# Altium project 15W-Dual-Transmitter.PrjPcb
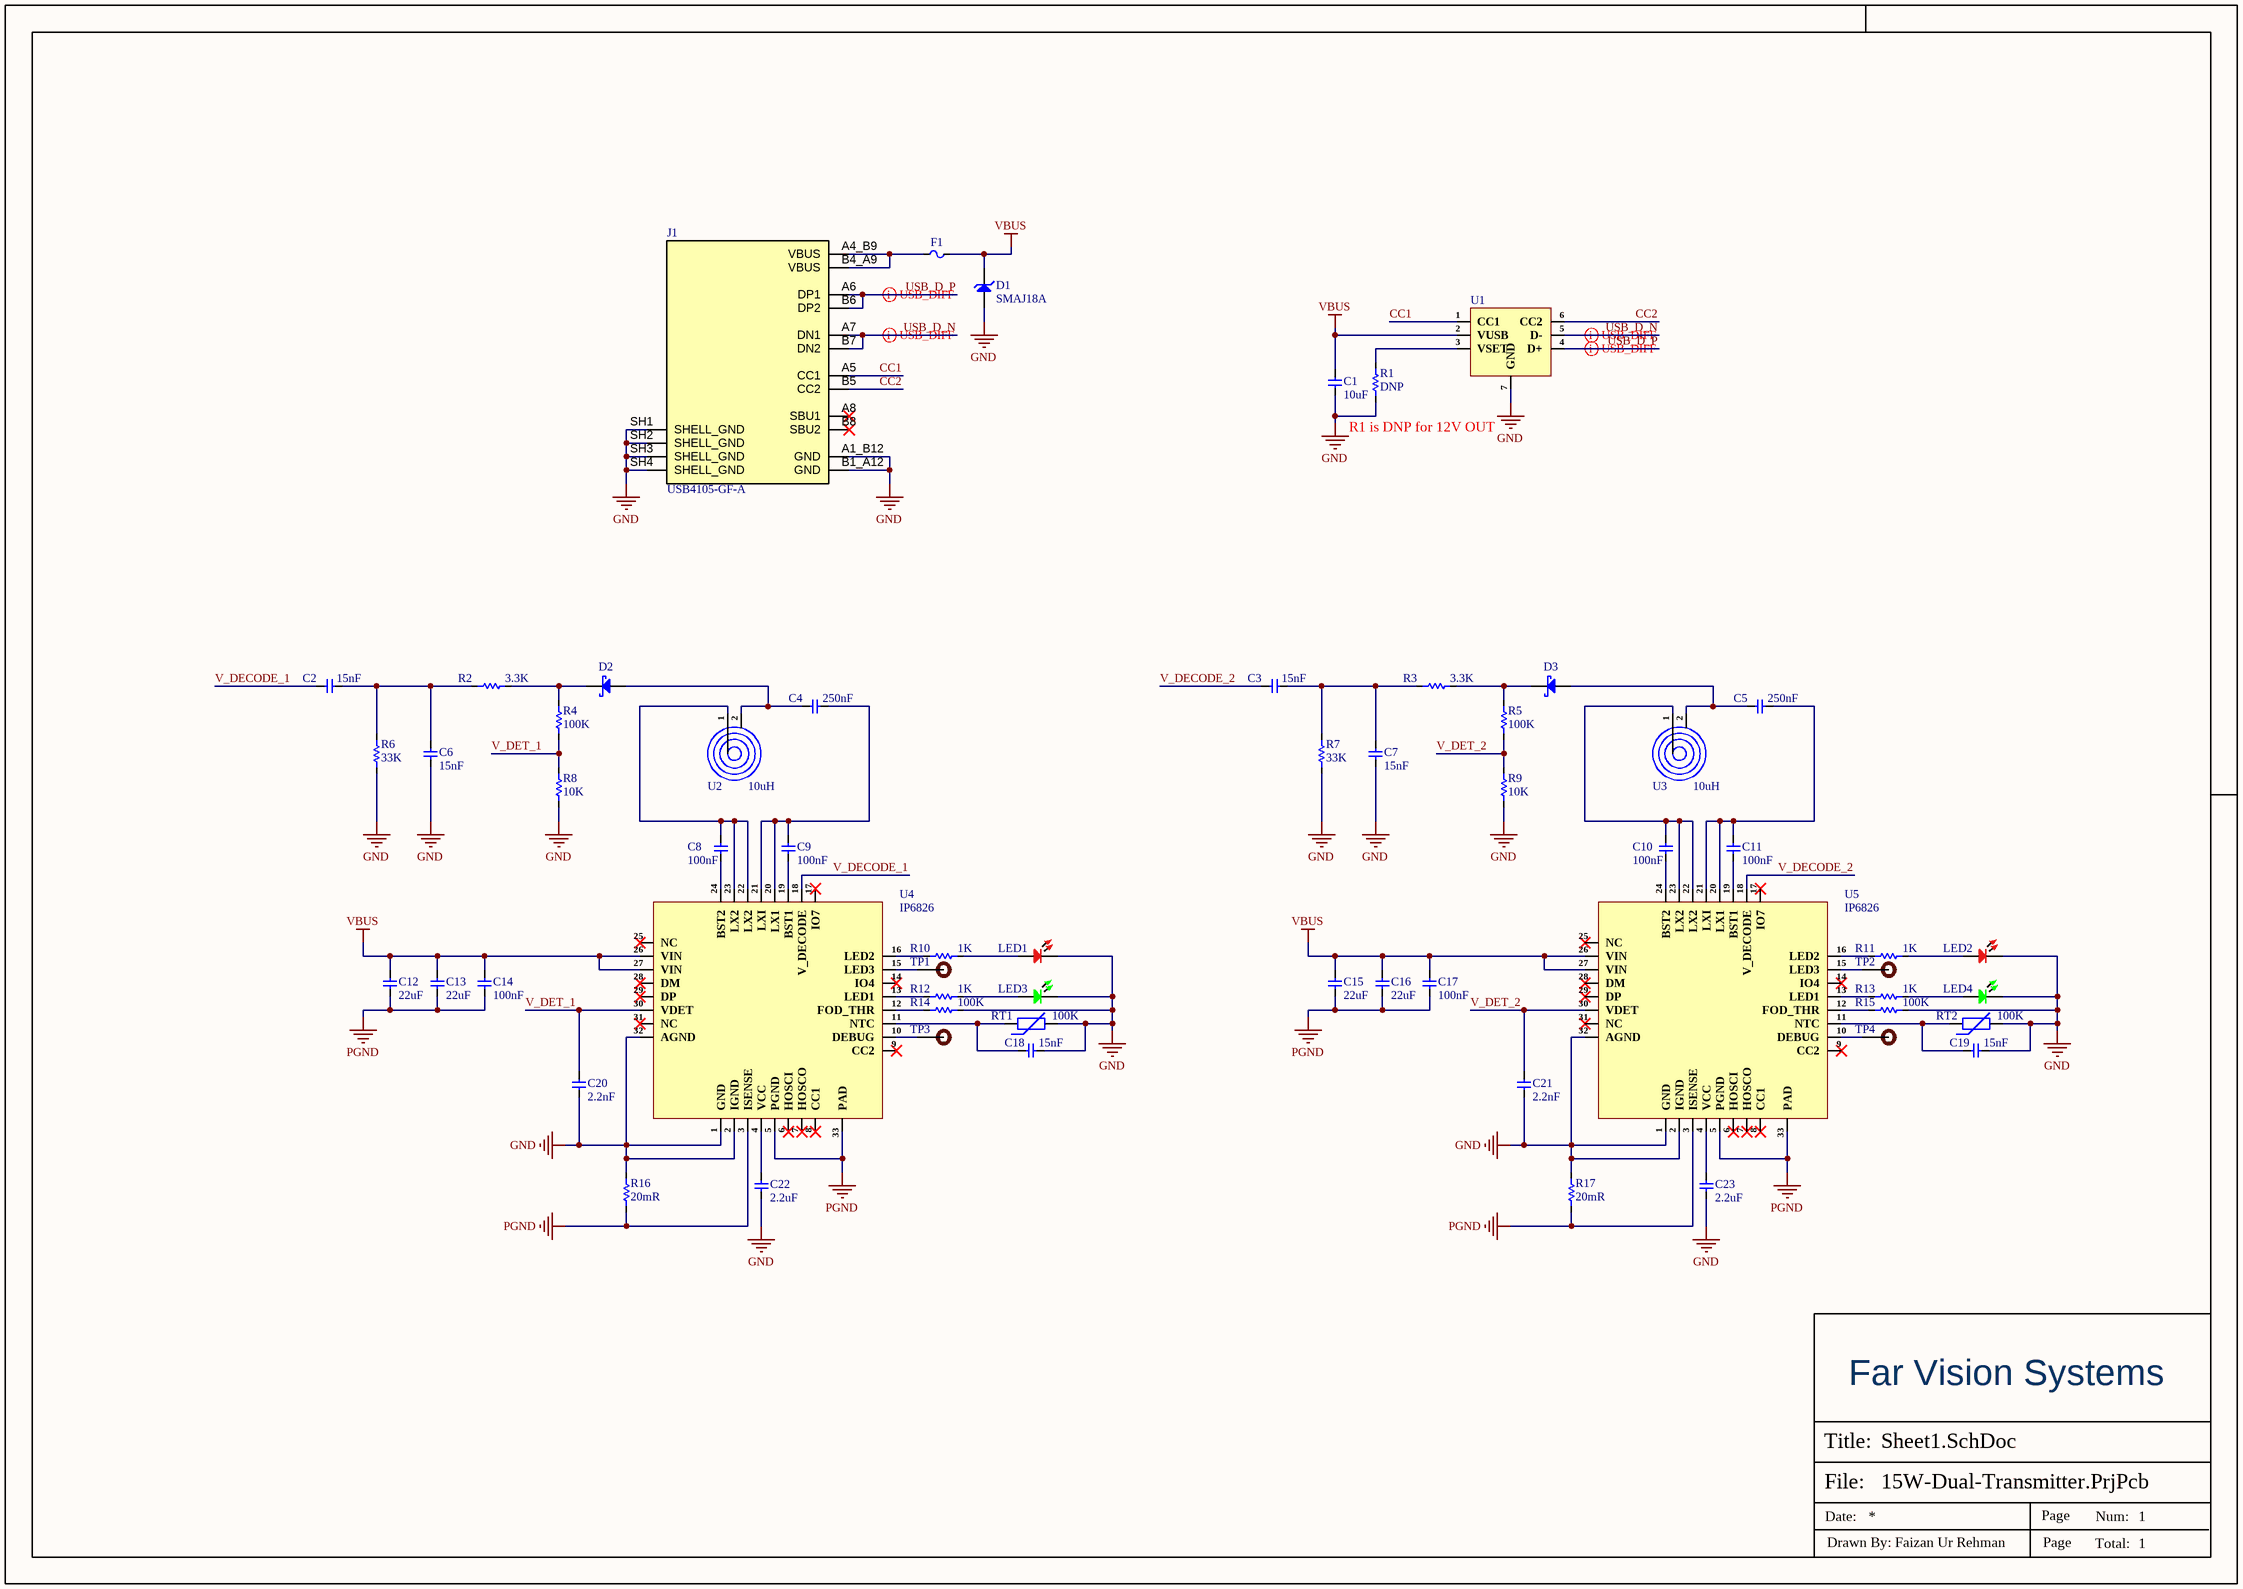
[diagram p0: Sheet1.SchDoc]
1 sheet, 60 parts. Net scope: global (net labels, ports and power ports of the same name join across sheets).
Board file: 15W-Dual-Transmitter.PcbDoc

## Sheet Sheet1.SchDoc
size 420 x 297 mm; SheetNumber: 1; SheetTotal: 1

### Parts
C1  10uF  [Cap-0603]
C2  15nF  [Cap-0603]
C3  15nF  [Cap-0603]
C4  250nF  [CAP-TH_L9.0-W3.5-P7.50-D1.0]
C5  250nF  [CAP-TH_L9.0-W3.5-P7.50-D1.0]
C6  15nF  [Cap-0603]
C7  15nF  [Cap-0603]
C8  100nF  [Cap-0603]
C9  100nF  [Cap-0603]
C10  100nF  [Cap-0603]
C11  100nF  [Cap-0603]
C12  22uF  [Cap-0805]
C13  22uF  [Cap-0805]
C14  100nF  [Cap-0603]
C15  22uF  [Cap-0805]
C16  22uF  [Cap-0805]
C17  100nF  [Cap-0603]
C18  15nF  [Cap-0603]
C19  15nF  [Cap-0603]
C20  2.2nF  [Cap-0603]
C21  2.2nF  [Cap-0603]
C22  2.2uF  [Cap-0603]
C23  2.2uF  [Cap-0603]
D1  SMAJ18A  [SMA(DO-214AC)]
D2  1N5819HW-7-F  [SOD-123]  (value not drawn)
D3  1N5819HW-7-F  [SOD-123]  (value not drawn)
F1  BSMD1812-300-24V  [Fuse-1812_]  (value not drawn)
J1  USB4105-GF-A  [GCT_USB4105-GF-A]
LED1  RED  [LED-0603]  (value not drawn)
LED2  RED  [LED-0603]  (value not drawn)
LED3  Emerald  [LED-0603]  (value not drawn)
LED4  Emerald  [LED-0603]  (value not drawn)
R1  DNP  [Res-0603]
R2  3.3K  [Res-0603]
R3  3.3K  [Res-0603]
R4  100K  [Res-0603]
R5  100K  [Res-0603]
R6  33K  [Res-0603]
R7  33K  [Res-0603]
R8  10K  [Res-0603]
R9  10K  [Res-0603]
R10  1K  [Res-0603]
R11  1K  [Res-0603]
R12  1K  [Res-0603]
R13  1K  [Res-0603]
R14  100K  [Res-0603]
R15  100K  [Res-0603]
R16  20mR  [RES-2512]
R17  20mR  [RES-2512]
RT1  100K  [Res-0603]
RT2  100K  [Res-0603]
TP1  TEST POINT  [Test-point]  (value not drawn)  (no BOM)
TP2  TEST POINT  [Test-point]  (value not drawn)  (no BOM)
TP3  TEST POINT  [Test-point]  (value not drawn)  (no BOM)
TP4  TEST POINT  [Test-point]  (value not drawn)  (no BOM)
U1  HUSB237-AA001-DN06R  [DFN-6L-EP(2x2)]  (value not drawn)
U2  10uH  [760308103102]
U3  10uH  [760308103102]
U4  IP6826  [QFN-32_L5.0-W5.0-P0.50-BL-EP3.8]
U5  IP6826  [QFN-32_L5.0-W5.0-P0.50-BL-EP3.8]

### Nets
GND: C1.1 C6.1 C7.1 C18.2 C19.2 C20.1 C21.1 C22.1 C23.1 D1.2(A) J1.A1_B12(GND) J1.B1_A12(GND) J1.SH1(SHELL_GND) J1.SH2(SHELL_GND) J1.SH3(SHELL_GND) J1.SH4(SHELL_GND) LED1.2 LED2.2 LED3.2 LED4.2 R1.1 R6.1 R7.1 R8.1 R9.1 R14.2 R15.2 R16.2 R17.2 RT1.2 RT2.2 U1.7(GND) U4.1(GND) U4.2(IGND) U4.32(AGND) U5.1(GND) U5.2(IGND) U5.32(AGND)
PGND: C12.1 C13.1 C14.1 C15.1 C16.1 C17.1 R16.1 R17.1 U4.3(ISENSE) U4.5(PGND) U4.33(PAD) U5.3(ISENSE) U5.5(PGND) U5.33(PAD)
VBUS: C1.2 C12.2 C13.2 C14.2 C15.2 C16.2 C17.2 D1.1(K) F1.2 U1.2(VUSB) U4.26(VIN) U4.27(VIN) U5.26(VIN) U5.27(VIN)
CC1: J1.A5(CC1) U1.1(CC1)
CC2: J1.B5(CC2) U1.6(CC2)
USB_D_N: J1.A7(DN1) J1.B7(DN2) U1.5(D-)
USB_D_P: J1.A6(DP1) J1.B6(DP2) U1.4(D+)
V_DECODE_1: C2.2 U4.18(V_DECODE)
V_DECODE_2: C3.2 U5.18(V_DECODE)
V_DET_1: C20.2 R4.1 R8.2 U4.30(VDET)
V_DET_2: C21.2 R5.1 R9.2 U5.30(VDET)
NetC2_1: C2.1 C6.2 R2.1 R6.2
NetC3_1: C3.1 C7.2 R3.1 R7.2
NetC4_1: C4.1 D2.1(A) U2.2
NetC4_2: C4.2 C9.2 U4.20(LX1) U4.21(LXI)
NetC5_1: C5.1 D3.1(A) U3.2
NetC5_2: C5.2 C11.2 U5.20(LX1) U5.21(LXI)
NetC8_1: C8.1 U4.24(BST2)
NetC8_2: C8.2 U2.1 U4.22(LX2) U4.23(LX2)
NetC9_1: C9.1 U4.19(BST1)
NetC10_1: C10.1 U5.24(BST2)
NetC10_2: C10.2 U3.1 U5.22(LX2) U5.23(LX2)
NetC11_1: C11.1 U5.19(BST1)
NetC18_1: C18.1 RT1.1 U4.11(NTC)
NetC19_1: C19.1 RT2.1 U5.11(NTC)
NetC22_2: C22.2 U4.4(VCC)
NetC23_2: C23.2 U5.4(VCC)
NetD2_2: D2.2(K) R2.2 R4.2
NetD3_2: D3.2(K) R3.2 R5.2
NetF1_1: F1.1 J1.A4_B9(VBUS) J1.B4_A9(VBUS)
NetLED1_1: LED1.1 R10.2
NetLED2_1: LED2.1 R11.2
NetLED3_1: LED3.1 R12.2
NetLED4_1: LED4.1 R13.2
NetR1_2: R1.2 U1.3(VSET)
NetR10_1: R10.1 U4.16(LED2)
NetR11_1: R11.1 U5.16(LED2)
NetR12_1: R12.1 U4.13(LED1)
NetR13_1: R13.1 U5.13(LED1)
NetR14_1: R14.1 U4.12(FOD_THR)
NetR15_1: R15.1 U5.12(FOD_THR)
NetTP1_1: TP1.1 U4.15(LED3)
NetTP2_1: TP2.1 U5.15(LED3)
NetTP3_1: TP3.1 U4.10(DEBUG)
NetTP4_1: TP4.1 U5.10(DEBUG)

Not connected (* = marked no-connect by the designer): J1 A8(SBU1)* B8(SBU2)*; U4 6(HOSCI)* 7(HOSCO)* 8(CC1)* 9(CC2)* 14(IO4)* 17(IO7)* 25(NC)* 28(DM)* 29(DP)* 31(NC)*; U5 6(HOSCI)* 7(HOSCO)* 8(CC1)* 9(CC2)* 14(IO4)* 17(IO7)* 25(NC)* 28(DM)* 29(DP)* 31(NC)*

### Layout directives
differential pair; net class USB_DIFF; differential pair class USB_DIFF_Lines; rule Matched Net Lengths [Tolerance = 20mil]; rule Impedance Constraint [Min = 85.00    Max = 95.00    ]: USB_D_N, USB_D_P

### Notes on the sheet
- R1 is DNP for 12V OUT
- Far Vision Systems
- File:
- Title:
- Date:
- Page
- Num:
- Total:
- Drawn By: Faizan Ur Rehman

### Library data of the parts
C1 = CAP-0603: GRM188R61E106KA73D
C2 C3 C6 C7 C18 C19 = CAP-0603: CC0402KRX7R9BB153
C4 C5 = MPP254J2A0701
C8-C11 C14 C17 = CAP-0603: GRM188R71H104KA93D
C12 C13 C15 C16 = CAP-0805: CC0805MKX5R8BB226
C20 C21 = CAP-0603: GRM188R71H222KA01D
C22 C23 = CAP-0603: GRM155R61E225KE11D
D1 = SMAJ18A: 13.7A 400W 29.2V 20V Unidirectional 18V SMA(DO-214AC) Electrostatic and Surge Protection (TVS/ESD) ROHS; Manufacturer: SMC; Manufacturer Part Number: SMAJ18A; Package: SMA(DO-214AC); LCSC Part Number: C499735; Item Type: TVS/ESD; ComponentLink1Description: LCSC; ComponentLink1URL: https://www.lcsc.com/product-detail/Electrostatic-and-Surge-Protection-TVS-ESD_SMC-Sangdest-Microelectronicstronic-Nanjing-SMAJ18A_C499735.html
D2 D3 = 1N5819HW-7-F: DIODE SCHOTTKY 40V 1A SOD123; Manufacturer: Diodes; Forward Voltage: 450mV; Max Reverse Current: 50uA; Element Configuration: Single; Max Forward Surge Current (Ifsm): 25A; Max Power Dissipation: 450mW; Polarity: Standard; Capacitance: 110pF; Supplier 1: Digi-Key; Manufacturer Part Number: 1N5819HW-7-F; RoHS: Yes; Category: Schottky Diodes; Pricing 1: 1=0.46000, 10=0.34500, 100=0.19530, 500=0.12936, 1000=0.09918 (USD); Case/Package: SOD-123-2; Number of Pins: 2; Weight: 0.000353oz; Contact Plating: Tin,Matte; Min Operating Temperature: -65°C; Max Operating Temperature: 125°C; Forward Current: 1A; Max Repetitive Reverse Voltage (Vrrm): 40V; Packaging: Tape and Reel; Peak Non-Repetitive Surge Current: 25A; Package Quantity: 3000; Average Rectified Current: 1A; Termination: SMD/SMT; Voltage Rating (DC): 40V; Current Rating: 1A; Output Current: 1A; Max Reverse Voltage (DC): 40V; Series: -; Length: 2.85mm; Width: 1.7mm; Height: 1.25mm; Radiation Hardening: No; RoHS Compliant: Yes; REACH SVHC: No SVHC; Lead Free: Lead Free; ComponentLink1URL: https://datasheet.ciiva.com/16303/ds30217-16303296.pdf?src-supplier=Future+Electronics; ComponentLink1Description: https://datasheet.ciiva.com/16303/ds30217-16303296.pdf?src-supplier=Future+Electronics; ComponentLink2URL: https://datasheet.ciiva.com/27092/1538419-27092484.pdf?src-supplier=Jameco; ComponentLink2Description: https://datasheet.ciiva.com/27092/1538419-27092484.pdf?src-supplier=Jameco; ComponentLink3URL: https://datasheet.ciiva.com/912/ds30217-912801.pdf?src-supplier=Digi-Key; ComponentLink3Description: https://datasheet.ciiva.com/912/ds30217-912801.pdf?src-supplier=Digi-Key; ComponentLink4URL: https://datasheet.ciiva.com/1177/ds30217-1177089.pdf?src-supplier=Element14; ComponentLink4Description: https://datasheet.ciiva.com/1177/ds30217-1177089.pdf?src-supplier=Element14; ComponentLink5URL: https://datasheet.ciiva.com/912/ds30217-912802.pdf?src-supplier=Digi-Key; ComponentLink5Description: https://datasheet.ciiva.com/912/ds30217-912802.pdf?src-supplier=Digi-Key; ComponentLink6URL: https://datasheet.ciiva.com/912/ds30217-912803.pdf?src-supplier=Digi-Key; ComponentLink6Description: https://datasheet.ciiva.com/912/ds30217-912803.pdf?src-supplier=Digi-Key; ComponentLink7URL: https://datasheet.ciiva.com/8303/ds30217-8303132.pdf?src-supplier=Avnet; ComponentLink7Description: https://datasheet.ciiva.com/8303/ds30217-8303132.pdf?src-supplier=Avnet; ComponentLink8URL: https://datasheet.ciiva.com/25919/ds30217-25919644.pdf?src-supplier=Avnet+Europe; ComponentLink8Description: https://datasheet.ciiva.com/25919/ds30217-25919644.pdf?src-supplier=Avnet+Europe; Supplier Part Number 1: 1N5819HW-FDICT-ND; LCSC Part Number: C82544; Item Type: Diode
F1 = BSMD1812-300-24V: 24V 3A 40A 6A 1812 Resettable Fuses ROHS; Manufacturer: BHFUSE; Item Type: Fuse; Supplier: LCSC; LCSC Part Number: C7500481; Manufacturer Part Number: BSMD1812-300-24V; RoHS: No; ComponentLink1Description: LCSC; ComponentLink1URL: https://www.lcsc.com/product-detail/Resettable-Fuses_BHFUSE-BSMD1812-300-24V_C7500481.html
J1 = USB4105-GF-A: MF: {'manufacturer': u'GCT'}; Package: None; Price: None; Value: *; MP: USB4105-GF-A; Availability: Unavailable
LED1 LED2 = NCD0603R3: RED LED 0603 Light Emitting Diodes; Manufacturer: Foshan NationStar Optoelectronics; Manufacturer Part Number: NCD0603R3; Package: 0603; Item Type: LED; LCSC Part Number: C3151730; ComponentLink1Description: LCSC; ComponentLink1URL: https://www.lcsc.com/product-detail/Light-Emitting-Diodes-LED_Foshan-NationStar-Optoelectronics-NCD0603R3_C3151730.html
LED3 LED4 = NCD0603G2: Emerald 0603 Light Emitting Diodes (LED) ROHS; Manufacturer: Foshan NationStar Optoelectronics; Manufacturer Part Number: NCD0603G2; Package: 0603; LCSC Part Number: C87326; Item Type: LED; ComponentLink1Description: LCSC; ComponentLink1URL: https://www.lcsc.com/product-detail/Light-Emitting-Diodes-LED_Foshan-NationStar-Optoelectronics-NCD0603G2_C87326.html
R1 R12 R13 = RES-0603
R2 R3 = RES-0603: RC0603FR-073K3L
R4 R5 R14 R15 = RES-0603: RT0603BRD07100KL
R6 R7 = RES-0603: RC0603FR-0733KL
R8 R9 = RES-0603: RC0603FR-0710KL
R10 R11 = RES-0603: RC0603FR-071KL
R16 R17 = PA2512FKE7W0R02E: RES 0.02 OHM 1% 2W 2512; Manufacturer: Yageo; Item Type: Resistor; Supplier: Digikey; LCSC Part Number: C375689; Manufacturer Part Number: PA2512FKE7W0R02E; RoHS: No; Stock: 3212; Pricing: 1=0.79, 10=0.514, 25=0.4384, 50=0.3908, 100=0.3503, 250=0.306, 500=0.27824, 1000=0.25464 (USD); ComponentLink1URL: https://datasheet.octopart.com/PA2512FKE7W0R02E-Yageo-datasheet-137700559.pdf?src-supplier=Newark; ComponentLink1Description: https://datasheet.octopart.com/PA2512FKE7W0R02E-Yageo-datasheet-137700559.pdf?src-supplier=Newark
RT1 RT2 = KNTC0603/100KF3950: 100kΩ 100uA 100mW 3950K ±1% 0603 NTC Thermistors ROHS; Manufacturer: KUU; Manufacturer Part Number: KNTC0603/100KF3950; Package: 0603; LCSC Part Number: C2892545; Item Type: NTC Thermistor; ComponentLink1Description: LCSC; ComponentLink1URL: https://lcsc.com/product-detail/NTC-Thermistors_KUU-KNTC0603-100KF3950_C2892545.html
TP1-TP4 = TEST POINT: Test Point ON; Item Type: TEST POINT
U1 = HUSB237-AA001-DN06R: DFN-6L-EP(2x2) USB PD ROHS; Manufacturer: Hynetek; Item Type: IC; Manufacturer Part Number: HUSB237-AA001-DN06R; Package: DFN-6L-EP(2x2); LCSC Part Number: C22373734; ComponentLink1Description: LCSC; ComponentLink1URL: https://www.lcsc.com/product-detail/USB-PD_Hynetek-HUSB237-AA001-DN06R_C22373734.html
U2 U3 = 760308103102: WE-WPCC Wireless Power Transfer Transmitter Coil, THT, Qi - MP-A2, 10uH, 150W; Manufacturer: Wurth Elektronik; DC Resistance Max: 55mOhm; Q Factor: 130; Rated Current: 7A; Self Resonant Frequency: 11MHz; Manufacturer Part Number: 760308103102; Category: Wireless Power Transmission; Match Code: WE-WPCC; ComponentLink1Description: Website Link; ComponentLink1URL: https://www.we-online.com/redexpert/article/760308103102?ad; ComponentLink2Description: Datasheet Link; ComponentLink2URL: https://www.we-online.com/redexpert/spec/760308103102?ad; Mount: Through Hole; Operating Temperature Max: 105°C; Operating Temperature Min: -20°C; Packaging: Tray; Length: 53; Width: 53; Height: 4.5mm; Compliance: Qi - MP-A2; Inductance: 10uH; Power Capability: 150W